# Altium schematic sheet TopLevel.SchDoc: Subboard Overview
size A4; Author: Marcel Hellwig; Organization: Hamburg Bit-Bots; Address1: Vogt-Kölln-Str. 30; Address2: 22527 Hamburg; Address3: Germany; Address4: www.bit-bots.de; DocumentNumber: 1; Revision: A; SheetNumber: 1; SheetTotal: 16; EMail: info@bit-bots.de
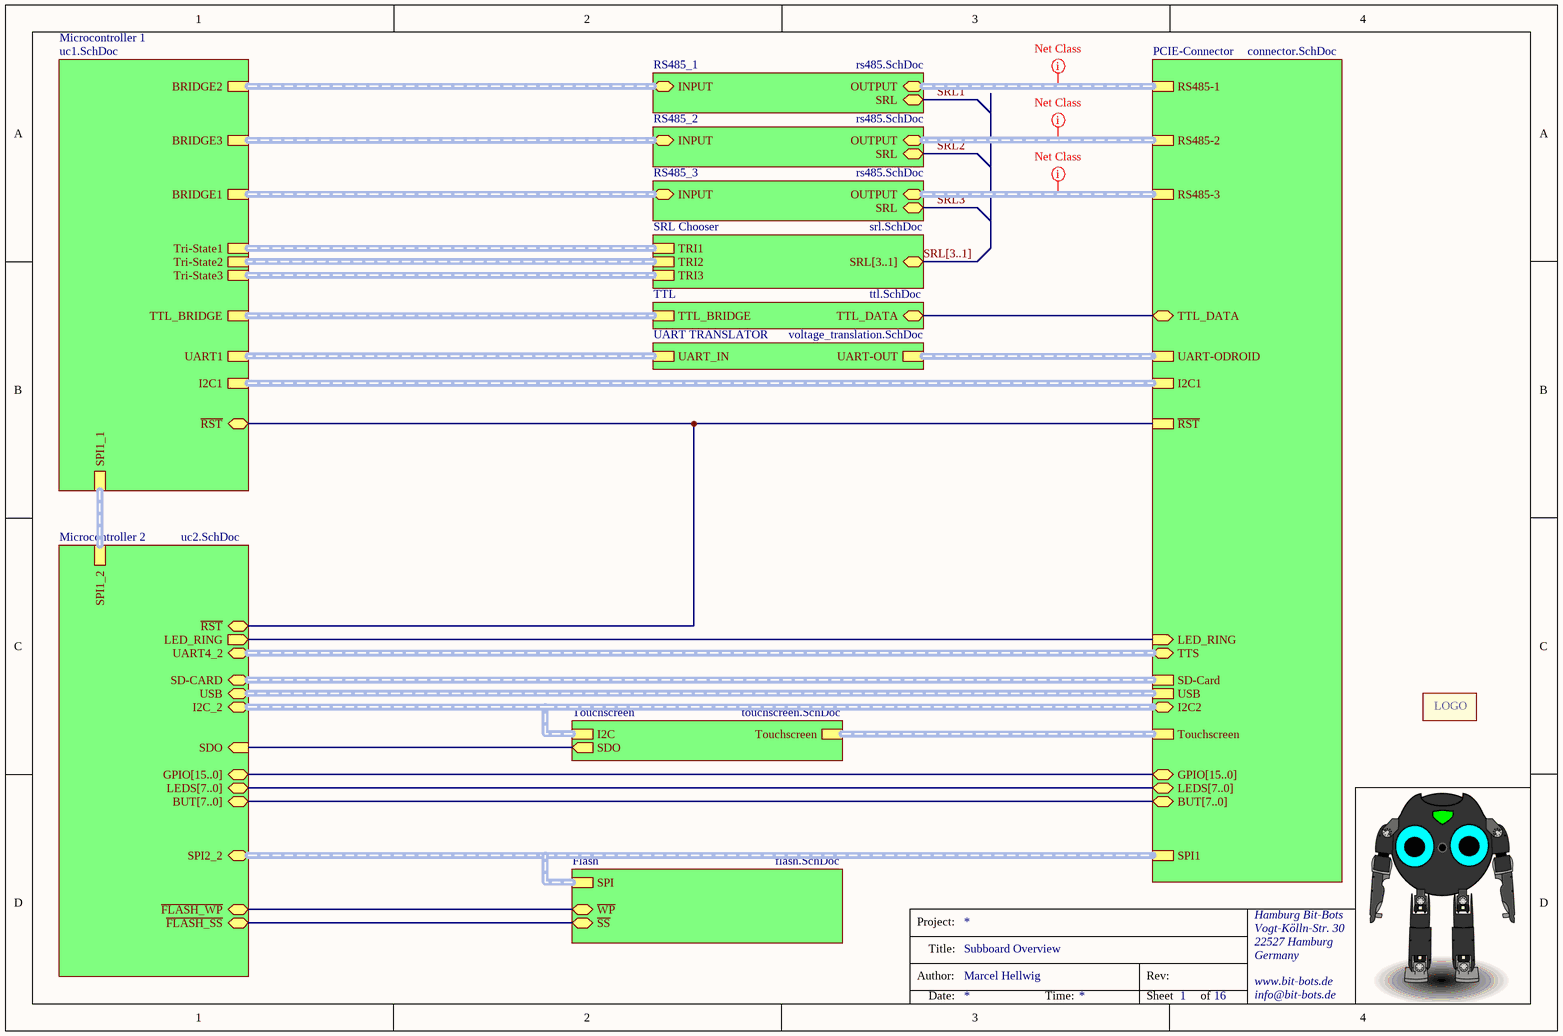
[diagram p0: TopLevel.SchDoc]

## Parts
Logo  Hamburg Bit-Bots Logo  [Logo]  (value not drawn)  (no BOM)

## Sub-sheets
Flash = flash.SchDoc: SPI (harness SPI), ~{WP} (bidir), ~{SS} (bidir)
Microcontroller 1 = uc1.SchDoc: BRIDGE1 (harness UART_RS485), BRIDGE2 (harness UART_RS485), BRIDGE3 (harness UART_RS485), TTL_BRIDGE (harness TTL), I2C1 (harness I²C), SPI1_1 (harness SPI), UART1 (harness UART), ~{RST}, Tri-State1 (harness Tri-State), Tri-State2 (harness Tri-State), Tri-State3 (harness Tri-State)
Microcontroller 2 = uc2.SchDoc: SPI1_2 (harness SPI), SD-CARD (harness SD-Card), USB (harness USB), I2C_2 (harness I²C), ~{RST}, SDO (in), GPIO[15..0] (bidir), LEDS[7..0] (bidir), BUT[7..0] (bidir), SPI2_2 (harness SPI), LED_RING (out), UART4_2 (harness UART), ~{FLASH_WP} (bidir), ~{FLASH_SS} (bidir)
PCIE-Connector = connector.SchDoc: LEDS[7..0] (bidir), BUT[7..0] (bidir), USB (harness USB), ~{RST}, SPI1 (harness SPI), UART-ODROID (harness UART), I2C1 (harness I²C), GPIO[15..0] (bidir), Touchscreen (harness Touchscreen), RS485-1 (harness RS-485), RS485-2 (harness RS-485), RS485-3 (harness RS-485), SD-Card (harness SD-Card), TTL_DATA (bidir), I2C2 (harness I²C), LED_RING (in), TTS (harness UART)
RS485_1 = rs485.SchDoc: SRL (bidir), INPUT (harness UART_RS485), OUTPUT (harness RS-485)
RS485_2 = rs485.SchDoc: SRL (bidir), INPUT (harness UART_RS485), OUTPUT (harness RS-485)
RS485_3 = rs485.SchDoc: SRL (bidir), INPUT (harness UART_RS485), OUTPUT (harness RS-485)
SRL Chooser = srl.SchDoc: SRL[3..1] (bidir), TRI1 (harness Tri-State), TRI2 (harness Tri-State), TRI3 (harness Tri-State)
Touchscreen = touchscreen.SchDoc: I2C (harness I²C), SDO (out), Touchscreen (harness Touchscreen)
TTL = ttl.SchDoc: TTL_BRIDGE (harness TTL), TTL_DATA (bidir)
UART TRANSLATOR = voltage_translation.SchDoc: UART-OUT (harness UART), UART_IN (harness UART)

## Nets
SRL1: sheet RS485_1/SRL
SRL2: sheet RS485_2/SRL
SRL3: sheet RS485_3/SRL
(unnamed): sheet PCIE-Connector/~{RST}, sheet Microcontroller 1/~{RST}, sheet Microcontroller 2/~{RST}
(unnamed): sheet PCIE-Connector/TTL_DATA, sheet TTL/TTL_DATA
(unnamed): sheet PCIE-Connector/LED_RING, sheet Microcontroller 2/LED_RING
(unnamed): sheet Touchscreen/SDO, sheet Microcontroller 2/SDO
(unnamed): sheet Microcontroller 2/~{FLASH_WP}, sheet Flash/~{WP}
(unnamed): sheet Microcontroller 2/~{FLASH_SS}, sheet Flash/~{SS}

## Buses and harness runs
bus sheet Microcontroller 2/BUT[7..0] = sheet PCIE-Connector/BUT[7..0]
bus sheet Microcontroller 2/GPIO[15..0] = sheet PCIE-Connector/GPIO[15..0]
bus sheet Microcontroller 2/LEDS[7..0] = sheet PCIE-Connector/LEDS[7..0]
bus SRL[3..1] = sheet SRL Chooser/SRL[3..1]
harness sheet Flash/SPI = sheet Microcontroller 2/SPI2_2 = sheet PCIE-Connector/SPI1
harness sheet Microcontroller 1/BRIDGE1 = sheet RS485_3/INPUT
harness sheet Microcontroller 1/BRIDGE2 = sheet RS485_1/INPUT
harness sheet Microcontroller 1/BRIDGE3 = sheet RS485_2/INPUT
harness sheet Microcontroller 1/I2C1 = sheet PCIE-Connector/I2C1
harness sheet Microcontroller 1/SPI1_1 = sheet Microcontroller 2/SPI1_2
harness sheet Microcontroller 1/Tri-State1 = sheet SRL Chooser/TRI1
harness sheet Microcontroller 1/Tri-State2 = sheet SRL Chooser/TRI2
harness sheet Microcontroller 1/Tri-State3 = sheet SRL Chooser/TRI3
harness sheet Microcontroller 1/TTL_BRIDGE = sheet TTL/TTL_BRIDGE
harness sheet Microcontroller 1/UART1 = sheet UART TRANSLATOR/UART_IN
harness sheet Microcontroller 2/I2C_2 = sheet PCIE-Connector/I2C2 = sheet Touchscreen/I2C
harness sheet Microcontroller 2/SD-CARD = sheet PCIE-Connector/SD-Card
harness sheet Microcontroller 2/UART4_2 = sheet PCIE-Connector/TTS
harness sheet Microcontroller 2/USB = sheet PCIE-Connector/USB
harness sheet PCIE-Connector/RS485-1 = sheet RS485_1/OUTPUT
harness sheet PCIE-Connector/RS485-2 = sheet RS485_2/OUTPUT
harness sheet PCIE-Connector/RS485-3 = sheet RS485_3/OUTPUT
harness sheet PCIE-Connector/Touchscreen = sheet Touchscreen/Touchscreen
harness sheet PCIE-Connector/UART-ODROID = sheet UART TRANSLATOR/UART-OUT

## Layout directives
net class RS485: (no net found under the mark)

## Notes on the sheet
- Project:
- Author:
- Title:
- Rev:
- Date:
- Time:
- Sheet
- of
- (in symbol Logo) LOGO

## Library data of the parts
Logo = Logo